# EAGLE design iGeigie-v3 (EAGLE 5.11)
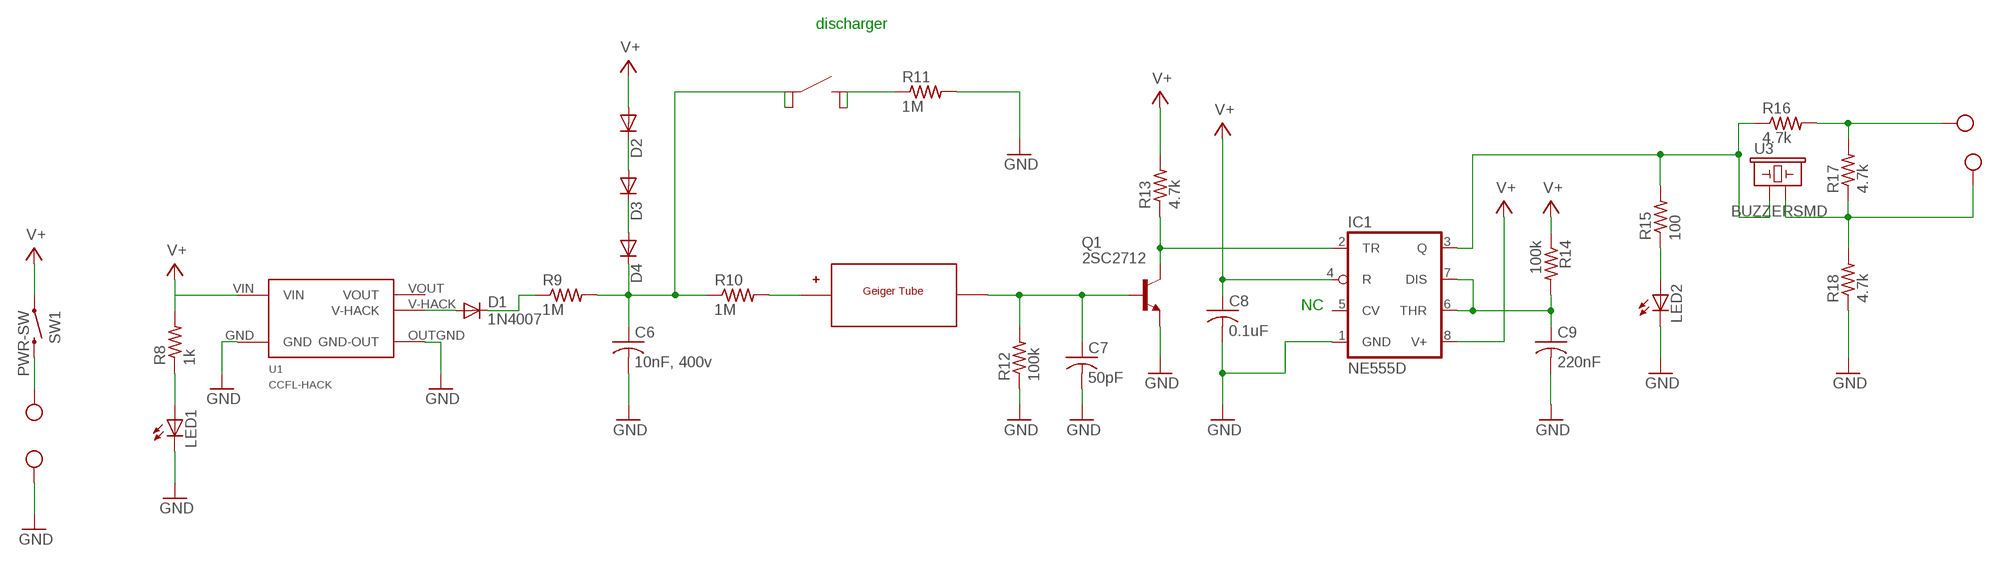
[diagram p0: schematic, sheet 1]

## Parts
C6  10nF, 400v  C-USC0805  [C0805]
C7  50pF  C-USC0805  [C0805]
C8  0.1uF  C-USC0805  [C0805]
C9  220nF  C-USC0805  [C0805]
D1  1N4007  DIODE-DO214BA  [DO214BA]
D2  DIODE-DO214AA  [DO214AA]
D3  DIODE-DO214AA  [DO214AA]
D4  DIODE-DO214AA  [DO214AA]
IC1  NE555D  [SO08]
LED1  LED3MM  [LED3MM]
LED2  LED3MM  [LED3MM]
Q1  2SC2712  BC846ASMD  [SOT23]
R8  1k  R-US_M0805  [M0805]
R9  1M  R-US_M0805  [M0805]
R10  1M  R-US_M0805  [M0805]
R11  1M  R-US_M0805  [M0805]
R12  100k  R-US_M0805  [M0805]
R13  4.7k  R-US_M0805  [M0805]
R14  100k  R-US_M0805  [M0805]
R15  100  R-US_M0805  [M0805]
R16  4.7k  R-US_M0805  [M0805]
R17  4.7k  R-US_M0805  [M0805]
R18  4.7k  R-US_M0805  [M0805]
SW1  PWR-SW  [PWR_SWITCH]
U1  CCFL-HACK  [CCFL-HACK]
U2  BUTTON  [KMR2]
U3  BUZZERSMD  [BUZZER-5MM]
U$1  PIN  [PIN]
U$2  PIN  [PIN]
U$3  PIN  [PIN]
U$4  PIN  [PIN]
U$5  GEIGER  [GEIGER]

## Nets
GND: C6.2 C7.2 C8.2 C9.2 IC1.1(GND) LED1.K(C) LED2.K(C) Q1.2(E) R11.2 R12.1 R18.1 U1.GND U1.OUTGND(GND-OUT) U$3.P$1
N$1: D2.C D3.A
N$2: D3.C D4.A
N$3: D1.A U1.V-HACK
N$4: LED2.A R15.1
N$12: SW1.2 U$4.P$1
N$14: LED1.A R8.1
N$15: D1.C R9.1
N$16: C6.1 D4.C R9.2 R10.1 U2.P1 U2.P1.1
N$19: R11.1 U2.P2 U2.P2.1
N$20: C7.1 Q1.1(B) R12.2 U$5.-
N$21: IC1.2(TR) Q1.3(C) R13.1
N$22: C9.1 IC1.6(THR) IC1.7(DIS) R14.2
N$23: IC1.3(Q) R15.2 R16.1 U3.+
N$24: R17.1 R18.2 U3.- U$1.P$1
N$25: R16.2 R17.2 U$2.P$1
N$27: R10.2 U$5.+
V+: C8.1 D2.A IC1.4(R) IC1.8(V+) R8.2 R13.2 R14.1 SW1.1 U1.VIN
Unconnected: IC1.5(CV) U1.VOUT

## Notes on the sheet
- discharger
- NC

## Library data of the parts
C6-C9 = resistor:C-US: CAPACITOR, American symbol
D1-D4 = diode:DIODE-: DIODE
IC1 = linear:*555: TIMER
LED1 LED2 = led:LED: LED OSRAM: - CHIPLED LG R971, LG N971, LY N971, LG Q971, LY Q971, LO R971, LY R971 LH N974, LH R974 LS Q976, LO Q976, LY Q976 LO Q996 - Hyper CHIPLED LW Q18S LB Q993, LB Q99A, LB R99A - SideLED LS A670, LO A670, LY A670, LG A670, LP A670 LB A673, LV A673, LT A673, LW A673 LH A674 LY A675 LS A676, LA A676, LO A676, LY A676, LW A676 LS A679, LY A679, LG A679 - Hyper Micro SIDELED® LS Y876, LA Y876, LO Y876, LY Y876 LT Y87S - SmartLED LW L88C, LW L88S LB L89C, LB L89S, LG L890 LS L89K, LO L89K, LY L89K LS L896, LA L896, LO L896, LY L896 - TOPLED LS T670, LO T670, LY T670, LG T670, LP T670 LSG T670, LSP T670, LSY T670, LOP T670, LYG T670 LG T671, LOG T671, LSG T671 LB T673, LV T673, LT T673, LW T673 LH T674 LS T676, LA T676, LO T676, LY T676, LB T676, LH T676, LSB T676, LW T676 LB T67C, LV T67C, LT T67C, LS T67K, LO T67K, LY T67K, LW E67C LS E67B, LA E67B, LO E67B, LY E67B, LB E67C, LV E67C, LT E67C LW T67C LS T679, LY T679, LG T679 LS T770, LO T770, LY T770, LG T770, LP T770 LB T773, LV T773, LT T773, LW T773 LH T774 LS E675, LA E675, LY E675, LS T675 LS T776, LA T776, LO T776, LY T776, LB T776 LHGB T686 LT T68C, LB T68C - Hyper Mini TOPLED® LB M676 - Mini TOPLED Santana® LG M470 LS M47K, LO M47K, LY M47K Source: http://www.osram.convergy.de LUXEON: - LUMILED® LXK2-PW12-R00, LXK2-PW12-S00, LXK2-PW14-U00, LXK2-PW14-V00 LXK2-PM12-R00, LXK2-PM12-S00, LXK2-PM14-U00 LXK2-PE12-Q00, LXK2-PE12-R00, LXK2-PE12-S00, LXK2-PE14-T00, LXK2-PE14-U00 LXK2-PB12-K00, LXK2-PB12-L00, LXK2-PB12-M00, LXK2-PB14-N00, LXK2-PB14-P00, LXK2-PB14-Q00 LXK2-PR12-L00, LXK2-PR12-M00, LXK2-PR14-Q00, LXK2-PR14-R00 LXK2-PD12-Q00, LXK2-PD12-R00, LXK2-PD12-S00 LXK2-PH12-R00, LXK2-PH12-S00 LXK2-PL12-P00, LXK2-PL12-Q00, LXK2-PL12-R00 Source: www.luxeon.com KINGBRIGHT: KA-3528ASYC Source: www.kingbright.com
Q1 = transistor-npn:BC846*: NPN Transistor
R8-R18 = resistor:R-US_: RESISTOR, American symbol
SW1 = iGeigie:PWR-SW
U1 = iGeigie:CCFL-HACK
U2 = iGeigie:BUTTON
U3 = iGeigie:BUZZER
U$1-U$4 = iGeigie:PIN
U$5 = iGeigie:GEIGER

## Board
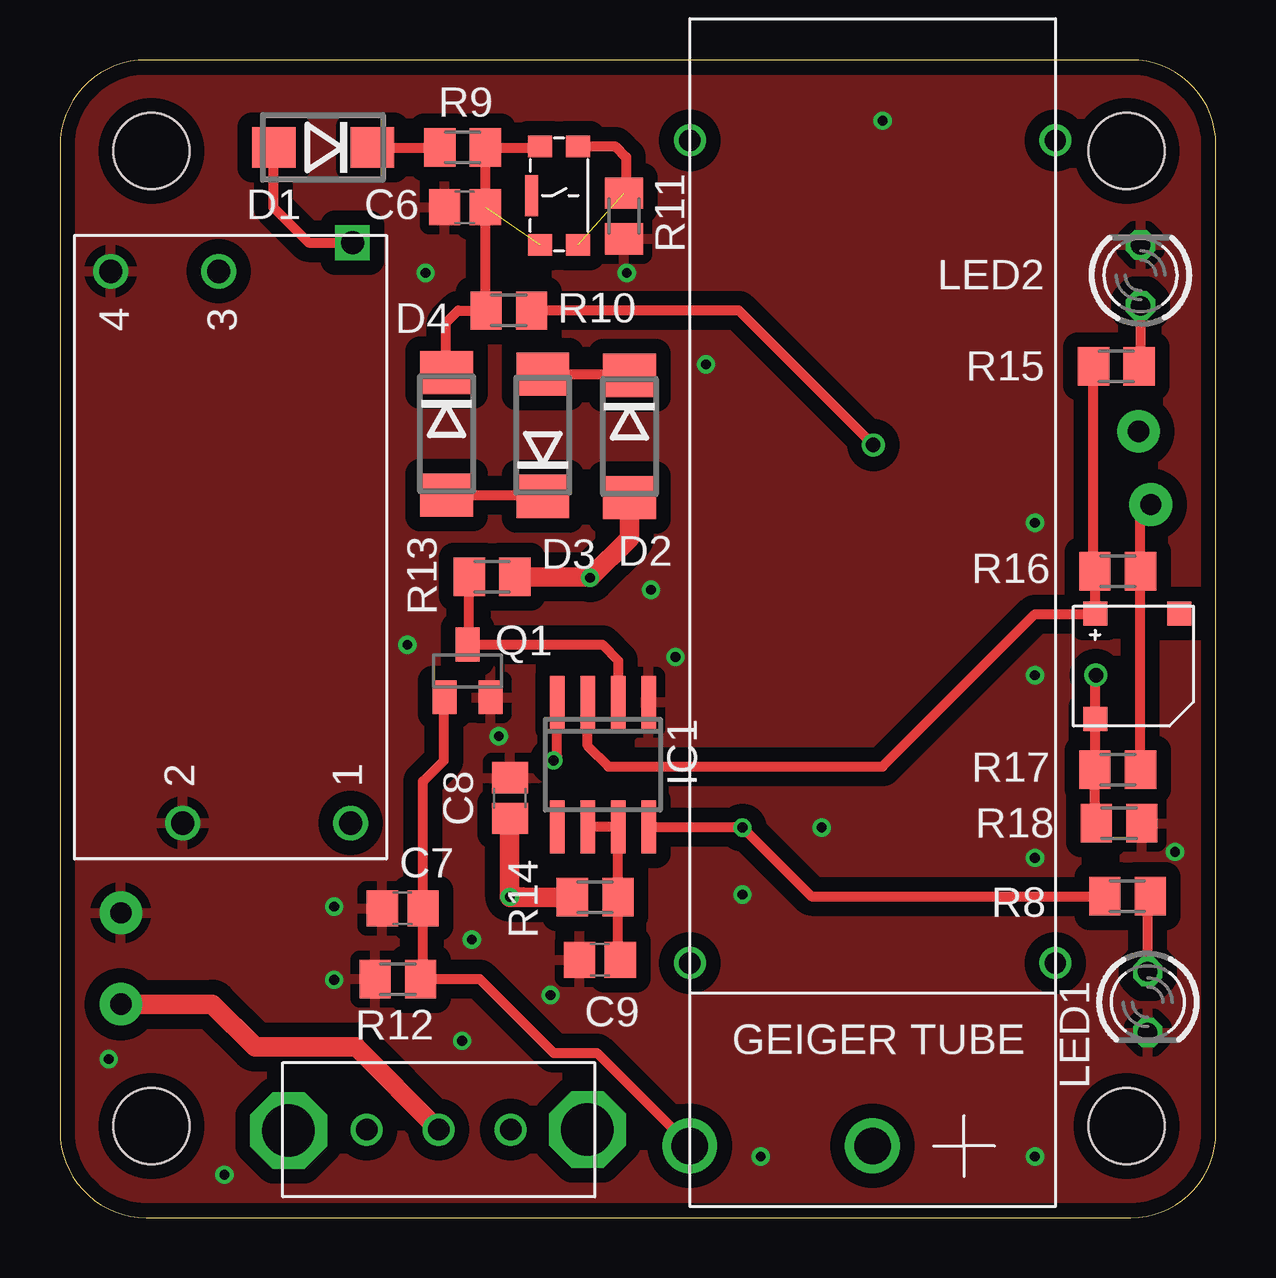
[diagram p1: board, top side]
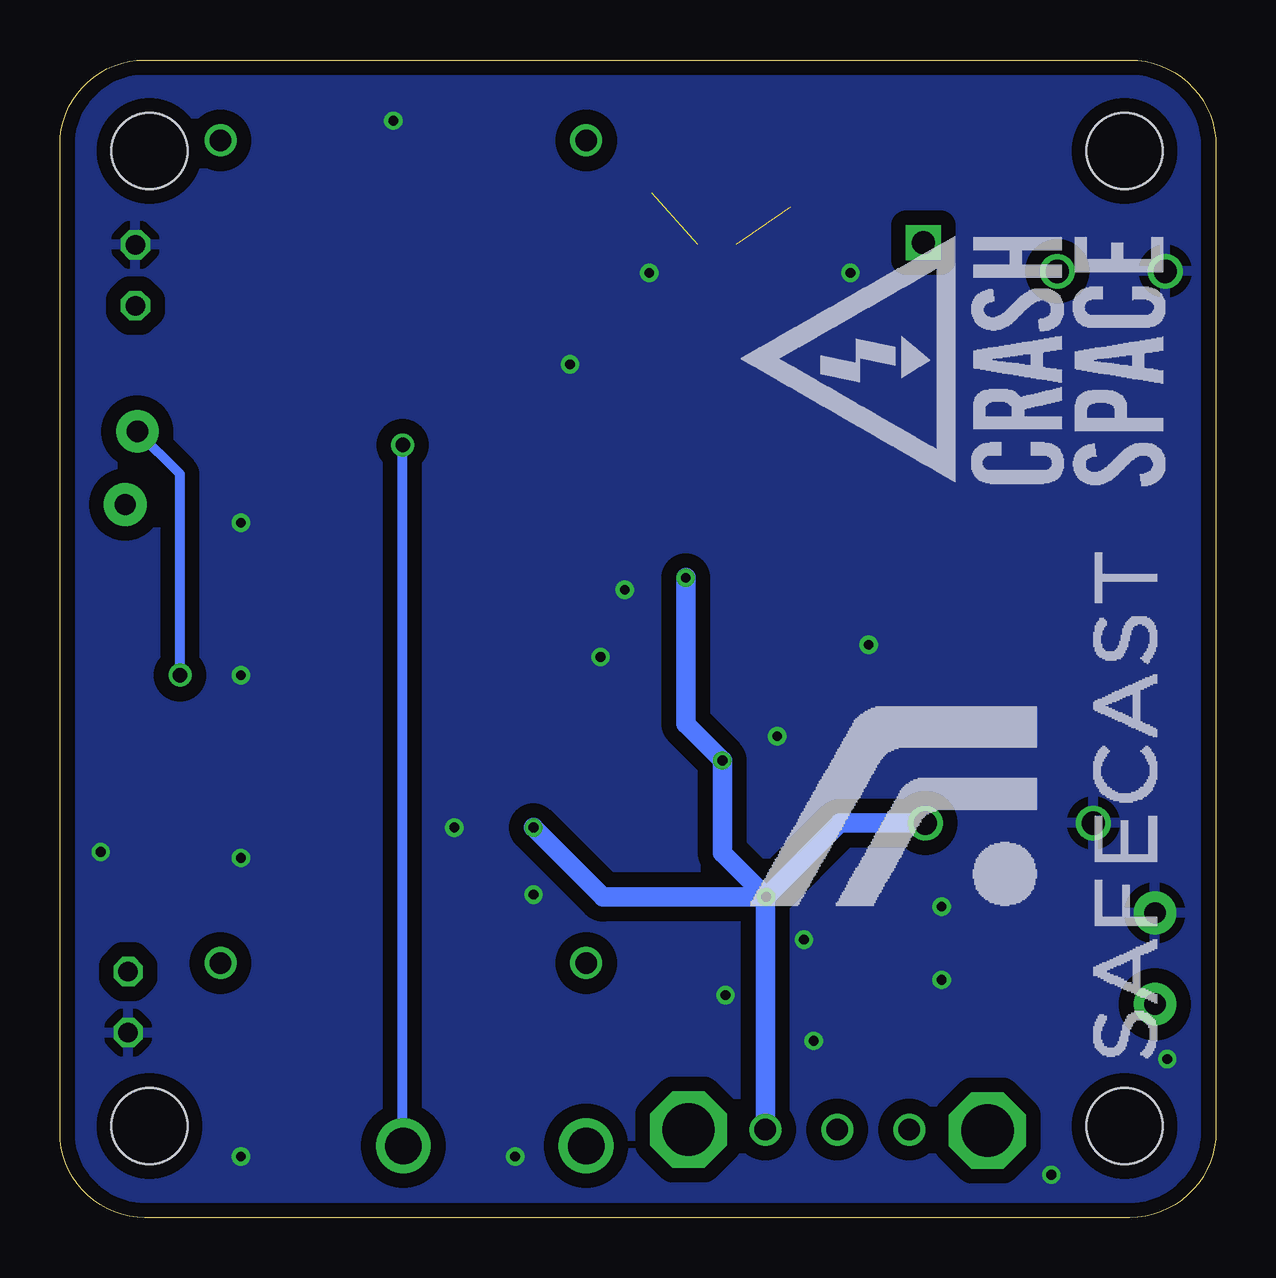
[diagram p2: board, bottom side, seen from below]

Size 48.18 x 48.25 mm. Coordinates in mm from the lower left corner, seen from the top.
Outline: 48.18,44.72 arc90 44.65,48.25 3.58,48.25 arc90 0,44.66 0,3.59 arc90 3.59,0 44.65,0 arc90 48.18,3.54 48.18,44.72
Copper layers (1*16): Top 0.0356mm / dielectric 1.5011mm / Bottom 0.0356mm
Design rules "LaenPCBOrder *": minimum track width 6mil, minimum drill 13mil, track to track 6mil, track to pad 6mil, pad to pad 6mil, via to via 6mil, smd to smd 6mil, copper to edge 15mil, drill to drill 6mil, minimum pad ring 7mil, minimum via ring 7mil, stop-mask expansion 4mil, vias tented up to drill 16mil, thermal gap 15mil
Holes 3.17 mm at 3.81,3.81 44.45,3.81 44.45,44.45 3.81,44.45

### Footprints (pad centres in the part's own frame; a part is rotated, then mirrored left to right if it is on the bottom)
C0805 = smd 1.3 x 1.5: 1 -0.85,0; 2 0.85,0
DO214BA = smd 1.8 x 1.7: A 2.05,0; C -2.05,0
DO214AA = smd 1.8 x 2.2: A 2.55,0; C -2.55,0
SO08 = smd 0.6 x 2.2: 1 -1.905,-2.6; 2 -0.635,-2.6; 3 0.635,-2.6; 4 1.905,-2.6; 5 1.905,2.6; 6 0.635,2.6; 7 -0.635,2.6; 8 -1.905,2.6
LED3MM = drill 0.813 octagon: A -1.27,0; K 1.27,0
SOT23 = smd 1 x 1.4: 1 -0.95,-1.1; 2 0.95,-1.1; 3 0,1.1
M0805 = smd 1.3 x 1.6: 1 -0.95,0; 2 0.95,0
PWR_SWITCH = drill 0.889 round: 1 -3,0; 2 0,0; 3 3,0 | drill 2.184 octagon: NC1 -6.2,0; NC2 6.26,0.04
CCFL-HACK = drill 0.965 round: GND -11.5,2; OUTGND 11.5,5; VIN -11.5,-5; VOUT 11.5,0.5 | drill 0.965 square: V-HACK 12.7,-5.08
KMR2 = smd 1.7 x 0.55: NC 0,1.15 | smd 0.9 x 1: P1 -2.05,0.8; P1.1 2.05,0.8; P2 -2.05,-0.8; P2.1 2.05,-0.8
BUZZER-5MM = smd 1 x 1: + -2.2,-1.6; - 2.2,-1.6; NC -2.2,1.9
PIN = drill 0.889 pad 1.778 round: P$1 0,0
GEIGER = drill 1.524 round: + 0,2.54; - 7.62,2.54 | drill 0.889 round: P$1 -7.62,-5.08; P$2 7.62,-5.08; P$3 7.62,-39.37; P$4 -7.62,-39.37

### Placement (x,y rotation side)
C6  16.88,42.11 180 top
C7  14.28,12.89 180 top
C8  18.75,17.48 90 top
C9  22.51,10.75 180 top
D1  10.97,44.6 180 top
D2  23.74,32.56 270 top
D3  20.13,32.61 90 top
D4  16.12,32.66 270 top
IC1  22.63,18.88 180 top
LED1  45.34,8.98 270 top
LED2  45.04,39.28 90 top
Q1  16.99,22.78 0 top
R8  44.5,13.39 180 top
R9  16.78,44.6 0 top
R10  18.71,37.8 0 top
R11  23.51,41.74 270 top
R12  14.08,9.94 0 top
R13  18.01,26.7 0 top
R14  22.31,13.35 0 top
R15  44.03,35.48 180 top
R16  44.09,26.94 0 top
R17  44.09,18.66 0 top
R18  44.15,16.44 180 top
SW1  15.79,3.66 180 top
U1  7.11,27.94 90 top
U2  20.8,42.6 90 top
U3  44.75,22.99 270 top
U$1  44.96,32.77 0 top
U$2  45.47,29.72 0 top
U$3  2.54,12.7 0 top
U$4  2.54,8.89 0 top
U$5  33.87,5.53 180 top

### Tracks (layer width: path | path; a pad name or v marks a point on that pad's centre or on a via)
GND  (via drill 0.41)
  other vias: 46.48,15.24 18.29,20.07 17.17,11.58 20.45,9.27 11.43,12.95 11.43,9.91 24.64,26.16 40.64,22.61 40.64,14.99 31.75,16.26 40.64,28.96 26.92,35.56 23.62,39.37 15.24,39.37 14.48,23.88 6.86,1.78 2.03,6.6 29.21,2.54 40.64,2.54 25.65,23.37 34.29,45.72 28.45,13.46 16.76,7.37
  pour Bottom (isolate 0.61): -0.51,58.17 101.6,58.17 101.6,-1.52 -0.51,-1.52
  pour Top (isolate 0.61): -1.02,0.25 -1.02,57.4 72.39,57.4 72.39,-7.62 -1.02,-7.62
N$1
  Top 0.406: D3.A 23.68,35.16 D2.C
N$2
  Top 0.406: D4.A 20.07,30.11 D3.C
N$3
  Top 0.406: U1.V-HACK 10.36,40.64 8.9,42.1 8.9,44.59 D1.A
N$4
  Top 0.406: LED2.A 45.04,35.54 R15.1
N$12
  Top 0.813: U$4.P$1 6.35,8.89 8.13,7.11 12.34,7.11 SW1.2
N$14
  Top 0.406: LED1.A 45.34,13.28 R8.1
N$15
  Top 0.406: D1.C R9.1
N$16  (1 unrouted)
  Top 0.406: U2.P1.1 19.95,44.6 R9.2 C6.1 17.73,37.83 R10.1 16.6,37.8 16.1,37.3 16.1,35.23 D4.C
N$19  (1 unrouted)
  Top 0.406: U2.P2.1 23.15,44.65 23.6,44.2 23.6,42.78 R11.1
N$20
  Top 0.406: U$5.- 22.38,6.86 20.57,6.86 17.49,9.94 R12.2 15.13,10.04 C7.1 15.13,18.18 16,19.05 16,21.14 Q1.1
N$21
  Top 0.406: IC1.2 23.27,23.22 22.61,23.88 Q1.3 17.06,23.96 R13.1
N$22
  Top 0.406: C9.1 23.26,10.85 R14.2 IC1.7 IC1.6
N$23
  Top 0.406: R15.2 43.08,27 R16.1 U3.+ 43.11,25.15 40.64,25.15 34.29,18.8 22.86,18.8 22,19.66 IC1.3
N$24  (via drill 0.6)
  Top 0.406: R18.2 43.14,17.26 R17.1 43.15,19.43 U3.- 43.15,22.57 v43.18,22.61
  Bottom 0.406: v43.18,22.61 43.18,30.99 U$1.P$1
N$25
  Top 0.406: R17.2 R16.2 45.04,29.29 U$2.P$1
N$27  (via drill 0.6)
  Top 0.406: R10.2 28.3,37.8 v33.9,32.2 | U$5.+ 33.9,3.02
  Bottom 0.406: v33.9,32.2 33.9,3.02 U$5.+
V+  (via drill 0.41)
  Top 0.406: R8.2 31.32,13.39 v28.45,16.26 24.56,16.26 IC1.8 | IC1.4 20.73,19.2 v20.57,19.05
  Top 0.813: 19.3,13.35 18.76,13.35 v18.75,13.36 | 19.3,13.35 R14.1 | v18.75,13.36 C8.1 | v18.75,13.36 19.29,13.36 19.3,13.35 | D2.A 23.74,28.31 v22.1,26.67 22.07,26.7 R13.2
  Bottom 0.813: SW1.1 18.79,13.32 v18.75,13.36 | U1.VIN 15.67,16.44 v18.75,13.36 | v28.45,16.26 25.55,13.36 v18.75,13.36 | v18.75,13.36 20.57,15.19 v20.57,19.05 22.1,20.57 v22.1,26.67